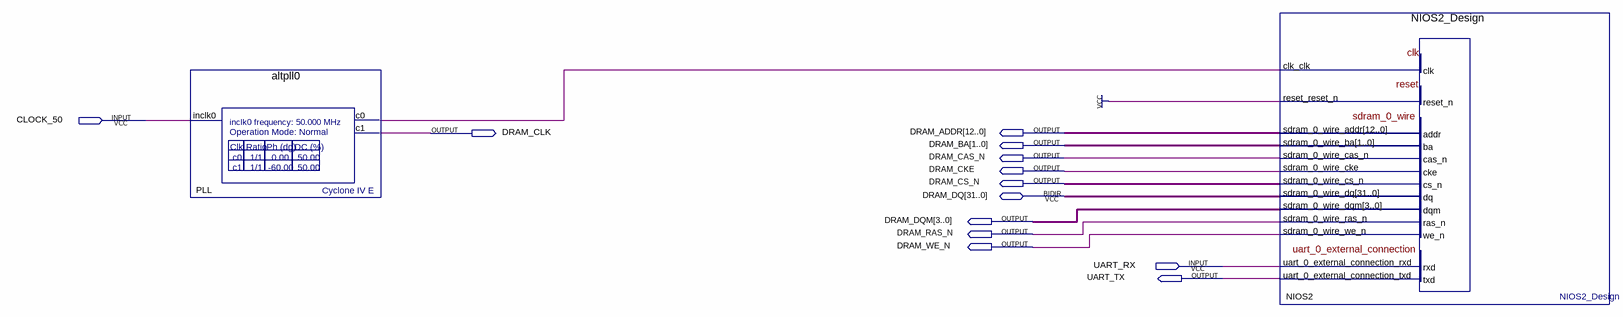
[diagram p0: schematic sheet]
// Quartus schematic NIOS2_PROJETO.bdf as structural Verilog: 2 symbols, 13 pins
module NIOS2_PROJETO (
  input  CLOCK_50,
  input  UART_RX,
  inout  [31:0] DRAM_DQ,
  output DRAM_CLK,
  output [12:0] DRAM_ADDR,
  output [1:0] DRAM_BA,
  output DRAM_CAS_N,
  output DRAM_CKE,
  output DRAM_CS_N,
  output [3:0] DRAM_DQM,
  output DRAM_RAS_N,
  output DRAM_WE_N,
  output UART_TX
);

  wire PLL_c0;

  altpll0 PLL (.inclk0(CLOCK_50), .c0(PLL_c0), .c1(DRAM_CLK));
  NIOS2_Design NIOS2 (
    .clk_clk(PLL_c0), .reset_reset_n(1'b1), .uart_0_external_connection_rxd(UART_RX),
    .sdram_0_wire_addr(DRAM_ADDR), .sdram_0_wire_ba(DRAM_BA), .sdram_0_wire_cas_n(DRAM_CAS_N),
    .sdram_0_wire_cke(DRAM_CKE), .sdram_0_wire_cs_n(DRAM_CS_N), .sdram_0_wire_dqm(DRAM_DQM),
    .sdram_0_wire_ras_n(DRAM_RAS_N), .sdram_0_wire_we_n(DRAM_WE_N), .uart_0_external_connection_txd(UART_TX),
    .sdram_0_wire_dq(DRAM_DQ));
endmodule
